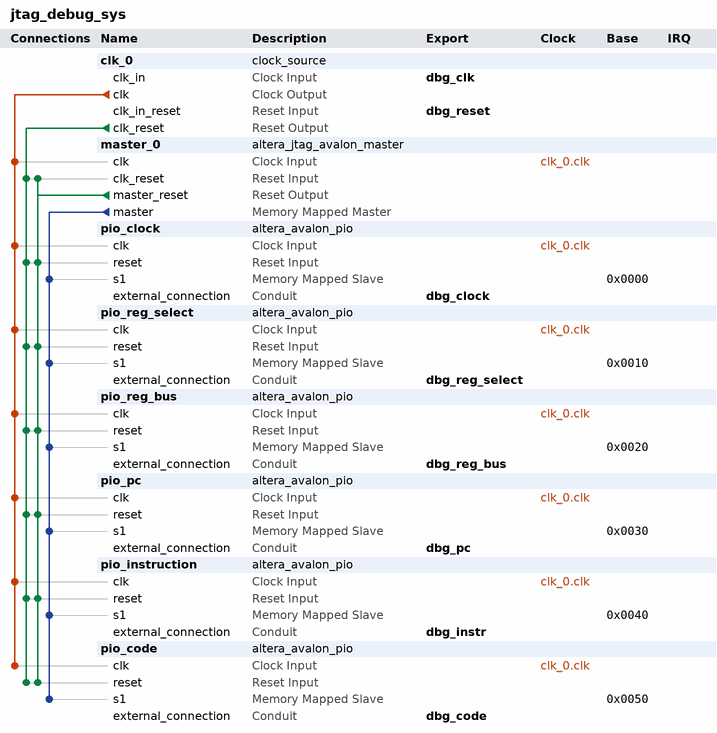
[diagram p0: system contents]
# Platform Designer (Qsys) system jtag_debug_sys, Cyclone IV E EP4CE6E22C8
# Parameters at their usual value, and those the tool derives, are not listed.
package require -exact qsys 23.1
create_system jtag_debug_sys
set_project_property DEVICE_FAMILY {Cyclone IV E}
set_project_property DEVICE EP4CE6E22C8

add_instance clk_0 clock_source 23.1
set_instance_parameter_value clk_0 clockFrequency 50000000

add_instance master_0 altera_jtag_avalon_master 23.1

add_instance pio_clock altera_avalon_pio 23.1
set_instance_parameter_value pio_clock direction Output
set_instance_parameter_value pio_clock width 1

add_instance pio_reg_select altera_avalon_pio 23.1
set_instance_parameter_value pio_reg_select direction Output
set_instance_parameter_value pio_reg_select width 5

add_instance pio_reg_bus altera_avalon_pio 23.1
set_instance_parameter_value pio_reg_bus direction Input
set_instance_parameter_value pio_reg_bus width 32

add_instance pio_pc altera_avalon_pio 23.1
set_instance_parameter_value pio_pc direction Input
set_instance_parameter_value pio_pc width 32

add_instance pio_instruction altera_avalon_pio 23.1
set_instance_parameter_value pio_instruction direction Input
set_instance_parameter_value pio_instruction width 11

add_instance pio_code altera_avalon_pio 23.1
set_instance_parameter_value pio_code direction Input
set_instance_parameter_value pio_code width 32

# connections
add_connection clk_0.clk master_0.clk clock
add_connection clk_0.clk pio_clock.clk clock
add_connection clk_0.clk pio_code.clk clock
add_connection clk_0.clk pio_instruction.clk clock
add_connection clk_0.clk pio_pc.clk clock
add_connection clk_0.clk pio_reg_bus.clk clock
add_connection clk_0.clk pio_reg_select.clk clock
add_connection clk_0.clk_reset master_0.clk_reset reset
add_connection clk_0.clk_reset pio_clock.reset reset
add_connection clk_0.clk_reset pio_code.reset reset
add_connection clk_0.clk_reset pio_instruction.reset reset
add_connection clk_0.clk_reset pio_pc.reset reset
add_connection clk_0.clk_reset pio_reg_bus.reset reset
add_connection clk_0.clk_reset pio_reg_select.reset reset
add_connection master_0.master_reset master_0.clk_reset reset
add_connection master_0.master_reset pio_clock.reset reset
add_connection master_0.master_reset pio_code.reset reset
add_connection master_0.master_reset pio_instruction.reset reset
add_connection master_0.master_reset pio_pc.reset reset
add_connection master_0.master_reset pio_reg_bus.reset reset
add_connection master_0.master_reset pio_reg_select.reset reset
add_connection master_0.master pio_clock.s1 avalon
set_connection_parameter_value master_0.master/pio_clock.s1 baseAddress 0x0000
add_connection master_0.master pio_code.s1 avalon
set_connection_parameter_value master_0.master/pio_code.s1 baseAddress 0x0050
add_connection master_0.master pio_instruction.s1 avalon
set_connection_parameter_value master_0.master/pio_instruction.s1 baseAddress 0x0040
add_connection master_0.master pio_pc.s1 avalon
set_connection_parameter_value master_0.master/pio_pc.s1 baseAddress 0x0030
add_connection master_0.master pio_reg_bus.s1 avalon
set_connection_parameter_value master_0.master/pio_reg_bus.s1 baseAddress 0x0020
add_connection master_0.master pio_reg_select.s1 avalon
set_connection_parameter_value master_0.master/pio_reg_select.s1 baseAddress 0x0010

# exported interfaces
add_interface dbg_clk clock sink
set_interface_property dbg_clk EXPORT_OF clk_0.clk_in
add_interface dbg_clock conduit end
set_interface_property dbg_clock EXPORT_OF pio_clock.external_connection
add_interface dbg_code conduit end
set_interface_property dbg_code EXPORT_OF pio_code.external_connection
add_interface dbg_instr conduit end
set_interface_property dbg_instr EXPORT_OF pio_instruction.external_connection
add_interface dbg_pc conduit end
set_interface_property dbg_pc EXPORT_OF pio_pc.external_connection
add_interface dbg_reg_bus conduit end
set_interface_property dbg_reg_bus EXPORT_OF pio_reg_bus.external_connection
add_interface dbg_reg_select conduit end
set_interface_property dbg_reg_select EXPORT_OF pio_reg_select.external_connection
add_interface dbg_reset reset sink
set_interface_property dbg_reset EXPORT_OF clk_0.clk_in_reset

set_interconnect_requirement {$system} qsys_mm.clockCrossingAdapter HANDSHAKE
set_interconnect_requirement {$system} qsys_mm.enableEccProtection FALSE
set_interconnect_requirement {$system} qsys_mm.insertDefaultSlave FALSE
set_interconnect_requirement {$system} qsys_mm.maxAdditionalLatency 1

save_system jtag_debug_sys.qsys
